# Altium schematic sheet Top.SchDoc
size B; DocumentNumber: 5; Revision: 1.1; SheetNumber: 1; SheetTotal: 4
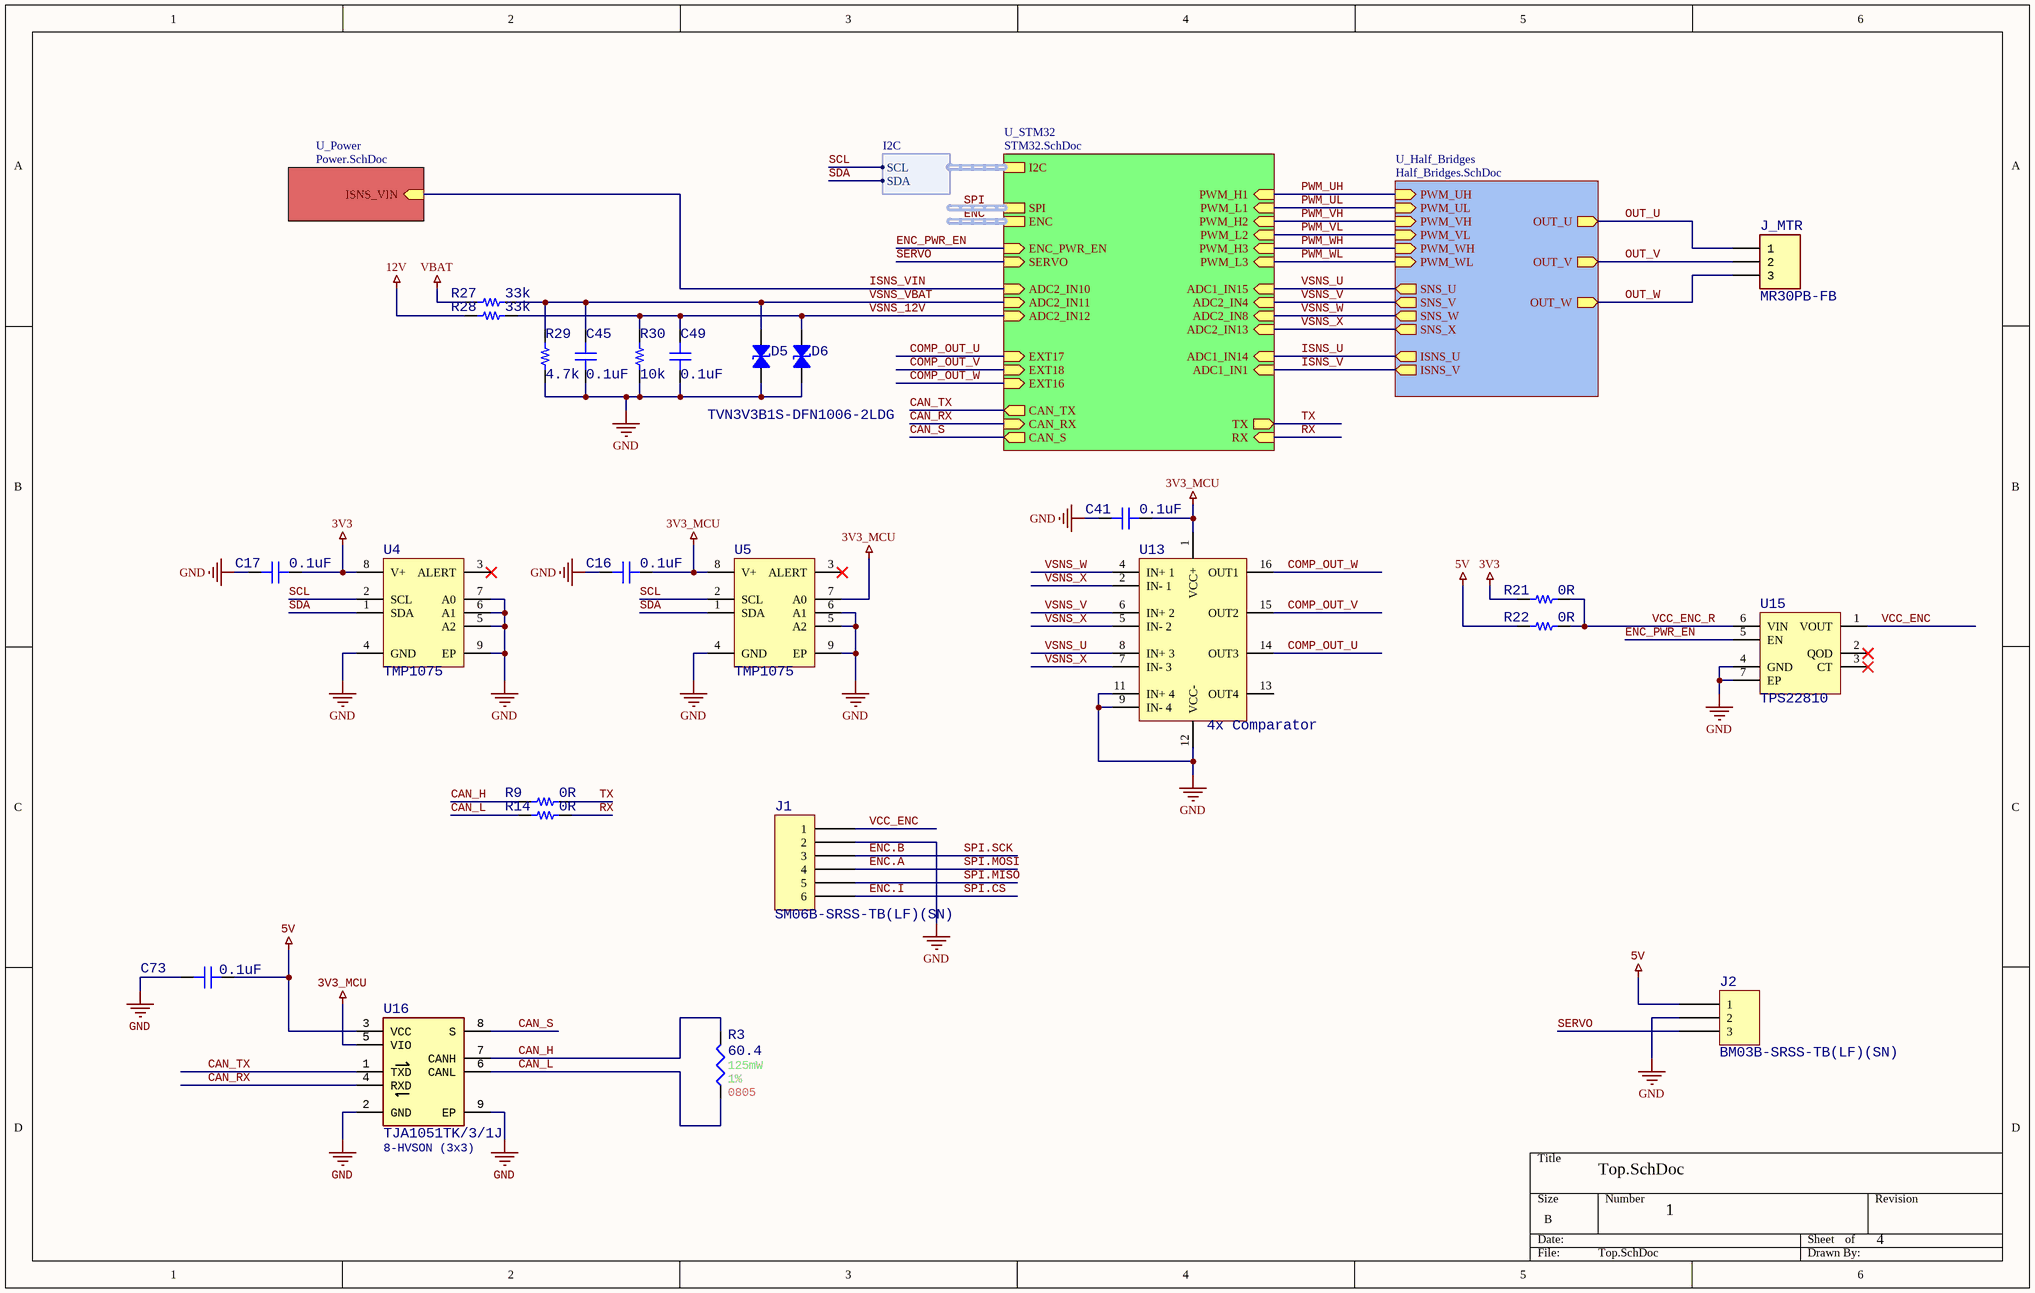
[diagram p0: Top.SchDoc]

## Parts
C16  0.1uF  [CAP_0402]
C17  0.1uF  [CAP_0402]
C41  0.1uF  [CAP_0402]
C45  0.1uF  [CAP_0402]
C49  0.1uF  [CAP_0402]
C73  0.1uF  [CAP_0402]
D5  TVN3V3B1S-DFN1006-2LDG  [0402]
D6  TVN3V3B1S-DFN1006-2LDG  [0402]  (value not drawn)
J1  SM06B-SRSS-TB(LF)(SN)  [JST SM06B-SRSS-TB]
J2  BM03B-SRSS-TB(LF)(SN)  [JST BM03B-SRSS-TB]
J_MTR  MR30PB-FB  [MR30PB-F]
R3  value 60.4  Power: 125mW  Tolerance: 1%  Case/Package: 0805  [0805 Resistor]  (hidden comment: TFA0805R60R4F-T5)
R9  0R  [RES_0402]
R14  0R  [RES_0402]
R21  0R  [RES_0402]
R22  0R  [RES_0402]
R27  33k  [RES_0402]
R28  33k  [RES_0402]
R29  4.7k  [RES_0402]
R30  10k  [RES_0402]
U4  TMP1075  [8_WSON_2x2_0.5mm]
U5  TMP1075  [8_WSON_2x2_0.5mm]
U13  4x Comparator  [QFN50P300X300X100-16N]
U15  TPS22810  [6-WSON_2x2_0.65mm]
U16  TJA1051TK/3/1J  Case/Package: 8-HVSON (3x3)  [TJA1044xxK]

## Sub-sheets
U_Half_Bridges = Half_Bridges.SchDoc: PWM_UH (in), PWM_UL (in), PWM_VH (in), PWM_VL (in), PWM_WH (in), PWM_WL (in), SNS_U (out), SNS_V (out), SNS_W (out), SNS_X (out), OUT_U (out), OUT_V (out), OUT_W (out), ISNS_U (out), ISNS_V (out)
U_Power = Power.SchDoc: ISNS_VIN (in)
U_STM32 = STM32.SchDoc: I2C (harness I2C), PWM_L1 (in), PWM_H1 (in), PWM_L2 (in), PWM_H2 (in), PWM_L3 (in), PWM_H3 (in), ENC (harness ENC), ADC1_IN1 (in), ADC1_IN14 (in), EXT16 (in), EXT17 (in), EXT18 (in), ADC2_IN10 (in), SPI (harness SPI), ENC_PWR_EN (in), ADC2_IN11 (in), ADC2_IN12 (in), ADC2_IN4 (in), ADC2_IN8 (in), ADC2_IN13 (in), ADC1_IN15 (in), SERVO (in), CAN_TX (out), CAN_RX (in), CAN_S (out), TX (out), RX (in)

## Harnesses
I2C: SCL, SDA

## Nets
3V3: C17.2 R21.2 U4.8(V+)
3V3_MCU: C16.2 C41.2 U5.7(A0) U5.8(V+) U13.1(VCC+) U16.5(VIO)
5V: C73.1 J2.1 R22.2 U16.3(VCC)
12V: R28.2
GND: C16.1 C17.1 C41.1 C45.1 C49.1 C73.2 D5.1 D6.1 J1.2 J2.2 R29.2 R30.2 U4.4(GND) U4.5(A2) U4.6(A1) U4.7(A0) U4.9(EP) U5.4(GND) U5.5(A2) U5.6(A1) U5.9(EP) U13.9(IN-_4) U13.11(IN+_4) U13.12(VCC-) U15.4(GND) U15.7(EP) U16.2(GND) U16.9(EP)
VBAT: R27.2
CAN_H: R3.2 R9.2 U16.7(CANH)
CAN_L: R3.1 R14.2 U16.6(CANL)
CAN_RX: U16.4(RXD) ; sheet U_STM32/CAN_RX
CAN_S: U16.8(S) ; sheet U_STM32/CAN_S
CAN_TX: U16.1(TXD) ; sheet U_STM32/CAN_TX
COMP_OUT_U: U13.14(OUT3) ; sheet U_STM32/EXT17
COMP_OUT_V: U13.15(OUT2) ; sheet U_STM32/EXT18
COMP_OUT_W: U13.16(OUT1) ; sheet U_STM32/EXT16
ENC.A: J1.4  [also labelled SPI.MOSI]
ENC.B: J1.3  [also labelled SPI.SCK]
ENC.I: J1.6  [also labelled SPI.~{CS}]
ENC_PWR_EN: U15.5(EN) ; sheet U_STM32/ENC_PWR_EN
ISNS_U: sheet U_STM32/ADC1_IN14, sheet U_Half_Bridges/ISNS_U
ISNS_V: sheet U_STM32/ADC1_IN1, sheet U_Half_Bridges/ISNS_V
ISNS_VIN: sheet U_STM32/ADC2_IN10, sheet U_Power/ISNS_VIN
OUT_U: J_MTR.1 ; sheet U_Half_Bridges/OUT_U
OUT_V: J_MTR.2 ; sheet U_Half_Bridges/OUT_V
OUT_W: J_MTR.3 ; sheet U_Half_Bridges/OUT_W
PWM_UH: sheet U_STM32/PWM_H1, sheet U_Half_Bridges/PWM_UH
PWM_UL: sheet U_STM32/PWM_L1, sheet U_Half_Bridges/PWM_UL
PWM_VH: sheet U_STM32/PWM_H2, sheet U_Half_Bridges/PWM_VH
PWM_VL: sheet U_STM32/PWM_L2, sheet U_Half_Bridges/PWM_VL
PWM_WH: sheet U_STM32/PWM_H3, sheet U_Half_Bridges/PWM_WH
PWM_WL: sheet U_STM32/PWM_L3, sheet U_Half_Bridges/PWM_WL
RX: R14.1 ; sheet U_STM32/RX
SCL: U4.2(SCL) U5.2(SCL) ; sheet U_STM32/I2C.SCL
SDA: U4.1(SDA) U5.1(SDA) ; sheet U_STM32/I2C.SDA
SERVO: J2.3 ; sheet U_STM32/SERVO
SPI.MISO: J1.5
TX: R9.1 ; sheet U_STM32/TX
VCC_ENC: J1.1 U15.1(VOUT)
VCC_ENC_R: R21.1 R22.1 U15.6(VIN)
VSNS_12V: C49.2 D6.2 R28.1 R30.1 ; sheet U_STM32/ADC2_IN12
VSNS_U: U13.8(IN+_3) ; sheet U_STM32/ADC1_IN15, sheet U_Half_Bridges/SNS_U
VSNS_V: U13.6(IN+_2) ; sheet U_STM32/ADC2_IN4, sheet U_Half_Bridges/SNS_V
VSNS_VBAT: C45.2 D5.2 R27.1 R29.1 ; sheet U_STM32/ADC2_IN11
VSNS_W: U13.4(IN+_1) ; sheet U_STM32/ADC2_IN8, sheet U_Half_Bridges/SNS_W
VSNS_X: U13.2(IN-_1) U13.5(IN-_2) U13.7(IN-_3) ; sheet U_STM32/ADC2_IN13, sheet U_Half_Bridges/SNS_X

Not connected (* = marked no-connect by the designer): U4 3(ALERT)*; U5 3(ALERT)*; U13 13(OUT4); U15 2(QOD)* 3(CT)*

## Buses and harness runs
harness ENC = sheet U_STM32/ENC
harness SPI = sheet U_STM32/SPI

## Library data of the parts
C16 C17 C41 C45 C49 C73 = CAP_0402: CAP CER 402; Value: 0.1uF
D5 D6 = TVN3V3B1S-DFN1006-2LDG: TVS DIODE 3.3V 14.2PF DFN1006; Manufacturer: INPAQ Technology Co., Ltd; Bidirectional Channels: 1; Capacitance @ Frequency: 11.5pF @ 1MHz; Current - Peak Pulse (10/1000µs): 8A (8/20µs); Power Line Protection: No; Type: Zener; Voltage - Breakdown (Min): 4V; Voltage - Clamping (Max) @ Ipp: 6.6V (Typ); Voltage - Reverse Standoff (Typ): 3.3V (Max); Part Number: TVN3V3B1S-DFN1006-2LDG; Applications: General Purpose; ComponentLink1Description: Datasheet; ComponentLink1URL: https://mm.digikey.com/Volume0/opasdata/d220001/medias/docus/5383/TVN3V3B1S-DFN1006-2LDG.pdf; ComponentLink2Description: DigiKey Link; ComponentLink2URL: https://www.digikey.com/en/products/detail/inpaq-technology-co-ltd/TVN3V3B1S-DFN1006-2LDG/20486686; Device Package: 0402 (1005 Metric); LastUpdated: 6/3/2024 8:22:57 PM; Lifecycle Status: Active; Minimum Order: 1; Mounting Type: Surface Mount; Operating Temperature: 150°C (TJ); Package / Case: 0402 (1005 Metric); Packaging: TapeAndReel; PartId: 11821; Price: 0.02; Series: TVN; Supplier 1: DigiKey; Supplier Part Number 1: 3526-TVN3V3B1S-DFN1006-2LDGCT-ND; Supplier Device Package: DFN1006
J1 = SM06B-SRSS-TB(LF)(SN): CONN HEADER SMD R/A 6POS 1MM; Manufacturer: JST Sales America Inc.; Current Rating (Amps): 0.7A; Material Flammability Rating: UL94 V-0; Number of Positions: 6; Number of Positions Loaded: All; Pitch - Mating: 0.039" (1.00mm); Shrouding: Shrouded - 4 Wall; Style: Board to Cable/Wire; Voltage Rating: 50V; Part Number: SM06B-SRSS-TB(LF)(SN); ComponentLink1Description: Datasheet; ComponentLink1URL: http://www.jst-mfg.com/product/pdf/eng/eSH.pdf; ComponentLink2Description: DigiKey Link; ComponentLink2URL: http://digikey.com/product-detail/en/jst-sales-america-inc/SM06B-SRSS-TB-LF-SN/455-1806-1-ND/926877; Connector Type: Header; Contact Finish - Mating: Tin; Contact Finish - Post: Tin; Contact Material: Copper Alloy; Contact Shape: Square; Contact Type: Male Pin; Fastening Type: Push-Pull; Features: Solder Retention; Insulation Color: Natural; Insulation Height: 0.114" (2.90mm); Insulation Material: Polyamide (PA), Nylon; LastUpdated: 1/12/2020 11:42:14 PM; Lifecycle Status: Active; Minimum Order: 1; Mounting Type: Surface Mount, Right Angle; Number of Rows: 1; Operating Temperature: -25°C ~ 85°C; Packaging: TapeAndReel; PartId: 64; Part Status: Active; Price: 0.36; Series: SR; Supplier 1: DigiKey; Supplier Part Number 1: 455-1806-1-ND; Termination: Solder
J2 = BM03B-SRSS-TB(LF)(SN): CONN HEADER SMD 3POS 1MM; Manufacturer: JST Sales America Inc.; Current Rating (Amps): 0.7A; Material Flammability Rating: UL94 V-0; Number of Positions: 3; Number of Positions Loaded: All; Pitch - Mating: 0.039" (1.00mm); Shrouding: Shrouded - 4 Wall; Style: Board to Cable/Wire; Voltage Rating: 50V; Part Number: BM03B-SRSS-TB(LF)(SN); ComponentLink1Description: Datasheet; ComponentLink1URL: http://www.jst-mfg.com/product/pdf/eng/eSR.pdf; ComponentLink2Description: DigiKey Link; ComponentLink2URL: http://digikey.com/product-detail/en/jst-sales-america-inc/BM03B-SRSS-TB-LF-SN/455-1789-1-ND/926860; Connector Type: Header; Contact Finish - Mating: Tin; Contact Finish - Post: Tin; Contact Material: Copper Alloy; Contact Shape: Square; Contact Type: Male Pin; Fastening Type: Push-Pull; Features: Solder Retention; Insulation Color: Natural; Insulation Height: 0.167" (4.25mm); Insulation Material: Polyamide (PA), Nylon; LastUpdated: 1/12/2020 10:12:14 PM; Lifecycle Status: Active; Minimum Order: 1; Mounting Type: Surface Mount; Number of Rows: 1; Operating Temperature: -25°C ~ 85°C; Packaging: TapeAndReel; PartId: 14; Part Status: Active; Price: 0.24; Series: SR; Supplier 1: DigiKey; Supplier Part Number 1: 455-1789-1-ND; Termination: Solder
J_MTR = CMP-002-00125-1: Vertical 3 pin barrel connector; Manufacturer: Amass; Gender: Female; Max Current Rating: 30A; Pins: 3
R3 = CMP-009-00189-2: Res 60.4 Ohm 1% 1/8W 0805; AECQ: Yes; Manufacturer Part Number: TFA0805R60R4F-T5; Mounting Technology: SMD; Pins: 2
R9 R14 R21 R22 R27-R30 = RES_0402: RES 0402
U4 U5 = TMP1075: I2C TEMP SENSOR
U13 = LM2901Q4T: Comparator General Purpose CMOS, DTL, MOS, Open-Collector, TTL 16-QFN (3x3)
U15 = TPS22810DRVR: Load switch TPS22810DRVR
U16 = CMP-031-00007-3: Interface Circuit, PDSO8; AECQ: Yes; Max Operating Temperature: 150°C; Pins: 8; Min Operating Temperature: -40°C